# EAGLE schematic schemat (EAGLE 8.7.0)
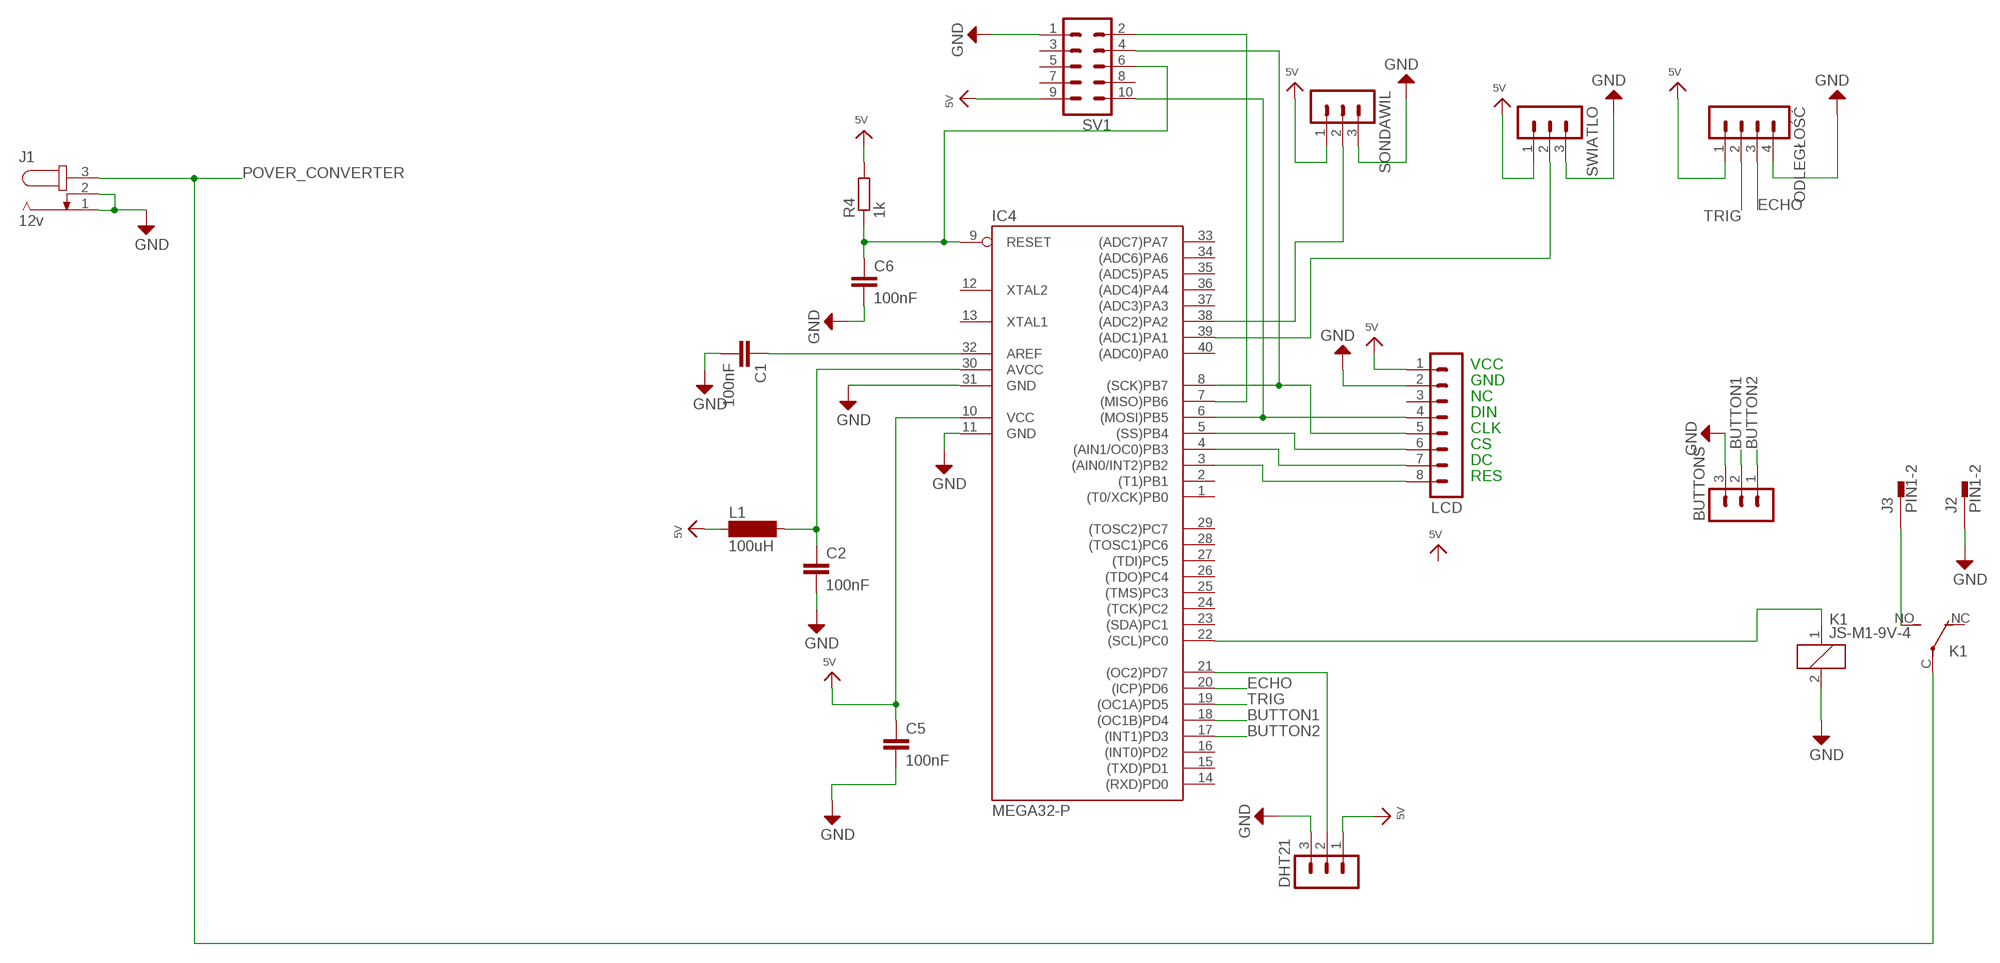
[diagram p0: schematic, sheet 1]

## Parts
BUTTONS  MA03-1  [MA03-1]
C1  100nF  C2.5/6  [C2.5-6]
C2  100nF  C2.5/6  [C2.5-6]
C5  100nF  C2.5/6  [C2.5-6]
C6  100nF  C2.5/6  [C2.5-6]
DHT21  MA03-1  [MA03-1]
IC4  MEGA32-P  [DIL40]
J1  12v  JACK-PLUG1  [SPC4078]
J2  PIN1-2  [62221]
J3  PIN1-2  [62221]
K1  JS-M1-9V-4  [JS-M]
L1  100uH  BS75  [BS75]
LCD  MA08-1  [MA08-1]
ODLEGŁOŚĆ  MA04-1  [MA04-1]
R4  1k  R-EU_0207/15  [0207/15]
SONDAWIL  MA03-1  [MA03-1]
SV1  MA05-2  [MA05-2]
SWIATLO  MA03-1  [MA03-1]

## Nets
BUTTON1: BUTTONS.2 IC4.18((OC1B)PD4)
BUTTON2: BUTTONS.1 IC4.17((INT1)PD3)
ECHO: ODLEGŁOŚĆ.3
GND: BUTTONS.3 C1.2 C2.2 C5.2 C6.2 DHT21.3 IC4.11(GND) IC4.31(GND) J1.1 J1.2 J2.1 K1.2 LCD.2 ODLEGŁOŚĆ.4 SONDAWIL.3 SV1.1 SWIATLO.3
N$1: IC4.39((ADC1)PA1) SWIATLO.2
N$2: C6.1 IC4.9(RESET) R4.1 SV1.6
N$3: IC4.6((MOSI)PB5) LCD.4 SV1.10
N$4: C1.1 IC4.32(AREF)
N$5: C2.1 IC4.30(AVCC) L1.2
N$6: IC4.8((SCK)PB7) LCD.5 SV1.4
N$7: IC4.5((SS)PB4) LCD.6
N$8: IC4.4((AIN1/OC0)PB3) LCD.7
N$9: IC4.3((AIN0/INT2)PB2) LCD.8
N$10: DHT21.2 IC4.21((OC2)PD7)
N$11: J3.1 K1.NO(2:S)
N$12: IC4.38((ADC2)PA2) SONDAWIL.2
N$13: IC4.22((SCL)PC0) K1.1
N$20: IC4.7((MISO)PB6) SV1.2
POVER_CONVERTER: J1.3 K1.C(2:P)
TRIG: ODLEGŁOŚĆ.2
VCC: C5.1 DHT21.1 IC4.10(VCC) L1.1 LCD.1 ODLEGŁOŚĆ.1 R4.2 SONDAWIL.1 SV1.9 SWIATLO.1 ; supply symbol labelled 5V
Unconnected: IC4.1((T0/XCK)PB0) IC4.2((T1)PB1) IC4.12(XTAL2) IC4.13(XTAL1) IC4.14((RXD)PD0) IC4.15((TXD)PD1) IC4.16((INT0)PD2) IC4.19((OC1A)PD5) IC4.20((ICP)PD6) IC4.23((SDA)PC1) IC4.24((TCK)PC2) IC4.25((TMS)PC3) IC4.26((TDO)PC4) IC4.27((TDI)PC5) IC4.28((TOSC1)PC6) IC4.29((TOSC2)PC7) IC4.33((ADC7)PA7) IC4.34((ADC6)PA6) IC4.35((ADC5)PA5) IC4.36((ADC4)PA4) IC4.37((ADC3)PA3) IC4.40((ADC0)PA0) K1.NC(2:O) LCD.3 SV1.3 SV1.5 SV1.7 SV1.8

## Notes on the sheet
- VCC
- GND
- NC
- DIN
- CLK
- CS
- DC
- RES

## Library data of the parts
BUTTONS DHT21 SONDAWIL SWIATLO = con-lstb:MA03-1: PIN HEADER; OC_FARNELL: unknown; OC_NEWARK: unknown
C1 C2 C5 C6 = capacitor-wima:C: CAPACITOR naming: grid - package width
IC4 = atmel:MEGA32-P: MICROCONTROLLER 32 Kbytes FLASH 2 Kbytes SRAM 1 Kbytes EEPROM USART 8-channel 10 bit ADC Source: www.atmel.com .. doc2503.pdf; MPN: ATMEGA32-16PU; OC_FARNELL: 1661729; OC_NEWARK: 51P1794
J1 = con-jack:JACK-PLUG: DC POWER JACK Power Jack, DC, Right Angle, Through Hole, Rated 5A at 16VDC, PC Terminals Distributor: Farnell (www.Farnell.de) Drawing: 84N1161.pdf / 84N1162.pdf Manufacturer: SPC Technology (www.spctechnology.com) Type: SPC4077 / SPC 4078; OC_FARNELL: unknown; OC_NEWARK: unknown
J2 J3 = con-faston:PIN1-2: CONN TAB FASTON BRASS .187 PCB TAB, FSSTON, DUAL STAKE, .187 SERIES Digi-Key Part Number: A24734CT-ND Source: Tyco Electronics Corporation .. ENG_CD_62221_R.pdf http://search.digikey.com/scripts/DkSearch/dksus.dll?Detail&name=A24734CT-ND; MF: TYCO ELECTRONICS; MPN: 62221-1; OC_FARNELL: unknown; OC_NEWARK: 16H2318
K1 = relay:JS-M1*: Automotive Ultra-Miniature Power Relay NAiS Source: http://www.mew-europe.com/.. en_ds_61211_0000.pdf; OC_FARNELL: unknown; OC_NEWARK: unknown
L1 = inductor-neosid:BS: INDUCTOR nominal inductance, magnetically screened; OC_FARNELL: unknown; OC_NEWARK: unknown
LCD = con-lstb:MA08-1: PIN HEADER; OC_FARNELL: unknown; OC_NEWARK: unknown
ODLEGŁOŚĆ = con-lstb:MA04-1: PIN HEADER; OC_FARNELL: unknown; OC_NEWARK: unknown
R4 = rcl:R-EU_: RESISTOR, European symbol; SPICEPREFIX: R
SV1 = con-lstb:MA05-2: PIN HEADER; OC_FARNELL: unknown; OC_NEWARK: unknown